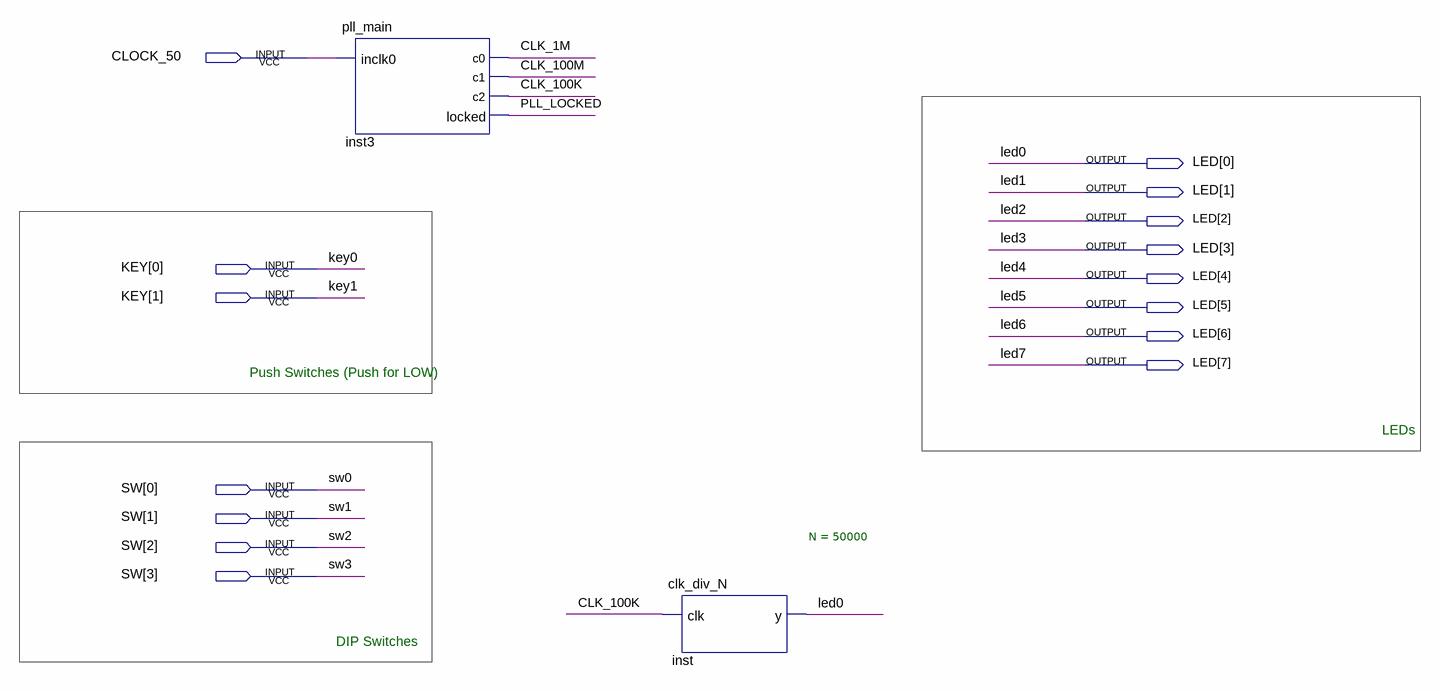
[diagram p0: schematic sheet]
// Quartus schematic TopLevelSchematic.bdf as structural Verilog: 2 symbols, 15 pins
module TopLevelSchematic (
  input  CLOCK_50,
  input  [1:0] KEY,
  input  [3:0] SW,
  output [7:0] LED
);

  wire CLK_1M, CLK_100K, CLK_100M, PLL_LOCKED;

  pll_main inst3 (.inclk0(CLOCK_50), .c0(CLK_1M), .c1(CLK_100M), .c2(CLK_100K), .locked(PLL_LOCKED));
  clk_div_N #(.N(50000)) inst (.clk(CLK_100K), .y(LED[0]));

  // Notes on the sheet:
  //   Push Switches (Push for LOW)
  //   LEDs
  //   DIP Switches
endmodule
